# Altium schematic sheet relayNetwork.SchDoc: DE:TMP:11:UC:EXPANDIDO
size 172 x 132 mm; Date: 21-07-2022; SheetNumber: 1; SheetTotal: 1; WebFGR: www.abebashop.com; VersionFGR: 20220721; PageSetup: Record=PageOptions|CenterHorizontal=True|CenterVertical=True|PrintScale=0.94|XCorrection=1.00|YCorrection=1.00|PrintKind=0|BorderSize=5000000|LeftOffset=0|BottomOffset=0|Orientation=2|PaperLength=1000|PaperWidth=1000|Scale=100|PaperSource=7|PrintQuality=-4|MediaType=1|DitherType=10|PaperKind=Letter|PrintScaleMode=1
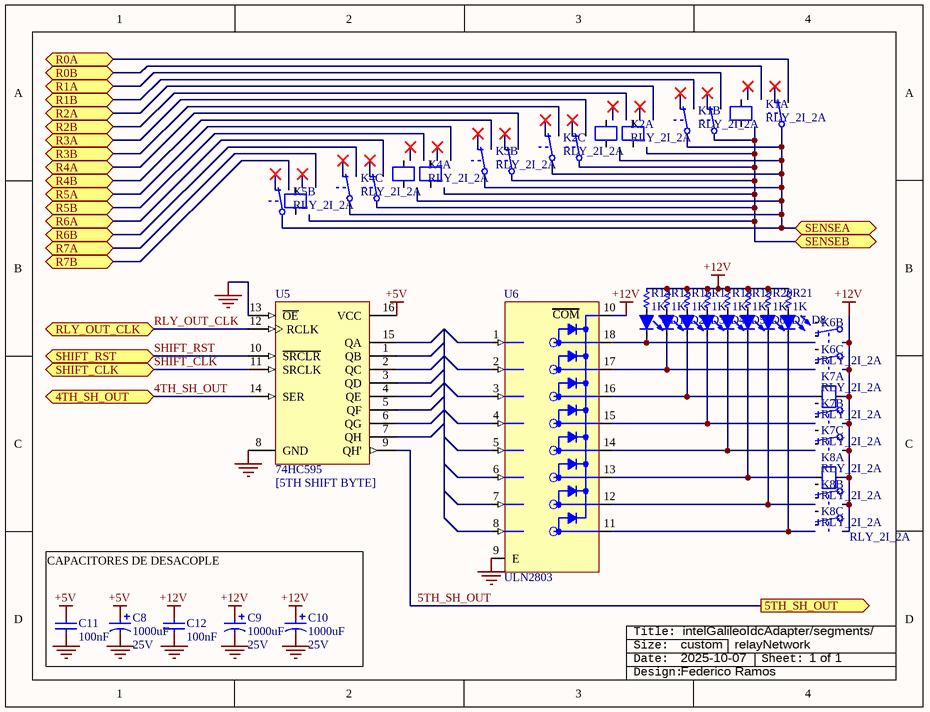
[diagram p0: relayNetwork.SchDoc]

## Parts
C8  value 1000uF  Voltaje: 25V  [C_EL_6-3X11]  (hidden comment: Cap Pol)
C9  value 1000uF  Voltaje: 25V  [C_EL_6-3X11]  (hidden comment: Cap Pol)
C10  value 1000uF  Voltaje: 25V  [C_EL_6-3X11]  (hidden comment: Cap Pol)
C11  value 100nF  [c1206]  (hidden comment: Cap)
C12  value 100nF  [c1206]  (hidden comment: Cap)
D1  Led 5mm Rojo Difuso  [LED5mm ROJO]  (value not drawn)
D2  Led 5mm Rojo Difuso  [LED5mm ROJO]  (value not drawn)
D3  Led 5mm Rojo Difuso  [LED5mm ROJO]  (value not drawn)
D4  Led 5mm Rojo Difuso  [LED5mm ROJO]  (value not drawn)
D5  Led 5mm Rojo Difuso  [LED5mm ROJO]  (value not drawn)
D6  Led 5mm Rojo Difuso  [LED5mm ROJO]  (value not drawn)
D7  Led 5mm Rojo Difuso  [LED5mm ROJO]  (value not drawn)
D8  Led 5mm Rojo Difuso  [LED5mm ROJO]  (value not drawn)
K1  RLY_2I_2A  [relay4]  (parts A,B,C of 3)
K2  RLY_2I_2A  [relay4]  (parts A,B,C of 3)
K3  RLY_2I_2A  [relay4]  (value not drawn)  (parts A,B,C of 3)
K4  RLY_2I_2A  [relay4]  (parts A,B,C of 3)
K5  RLY_2I_2A  [relay4]  (value not drawn)  (parts A,B,C of 3)
K6  RLY_2I_2A  [relay4]  (value not drawn)  (parts A,B,C of 3)
K7  RLY_2I_2A  [relay4]  (parts A,B,C of 3)
K8  RLY_2I_2A  [relay4]  (parts A,B,C of 3)
R14  value 1K  [R1206]  (hidden comment: Res)
R15  value 1K  [R1206]  (hidden comment: Res)
R16  value 1K  [R1206]  (hidden comment: Res)
R17  value 1K  [R1206]  (hidden comment: Res)
R18  value 1K  [R1206]  (hidden comment: Res)
R19  value 1K  [R1206]  (hidden comment: Res)
R20  value 1K  [R1206]  (hidden comment: Res)
R21  value 1K  [R1206]  (hidden comment: Res)
ROT?  Rotulo_empty_longTitle  (value not drawn)  (graphical)
U5  74HC595  [DIP16]
U6  ULN2803  [DIP18Z]

## Ports
4TH_SH_OUT, 5TH_SH_OUT (out), R0A, R0B, R1A, R1B, R2A, R2B, R3A, R3B, R4A, R4B, R5A, R5B, R6A, R6B, R7A, R7B, RLY_OUT_CLK, SENSEA, SENSEB, SHIFT_CLK, SHIFT_RST

## Nets
+5V: C8.1 C11.2 U5.16(VCC)
+12V: C9.1 C10.1 C12.2 K7.5 K8.5 R14.2 R15.2 R16.2 R17.2 R18.2 R19.2 R20.2 R21.2 U6.10(~{COM})
GND: C8.2 C9.2 C10.2 C11.1 C12.1 U5.8(GND) U5.13(~{OE}) U6.9(E)
4TH_SH_OUT: U5.14(SER) ; port 4TH_SH_OUT
5TH_SH_OUT: U5.9(QH') ; port 5TH_SH_OUT
R0A: K1.8 ; port R0A
R1A: K2.3 ; port R1A
R1B: K1.3 ; port R1B
R3A: K3.8 ; port R3A
R3B: K2.8 ; port R3B
R4A: K4.3 ; port R4A
R4B: K3.3 ; port R4B
R6A: K5.8 ; port R6A
R6B: K4.8 ; port R6B
R7B: K5.3 ; port R7B
RLY_OUT_CLK: U5.12(RCLK) ; port RLY_OUT_CLK
SENSEA: K1.1 K1.6 K2.6 K3.1 K4.6 K5.1 ; port SENSEA
SENSEB: K2.1 K3.6 K4.1 K5.6 ; port SENSEB
SHIFT_CLK: U5.11(SRCLK) ; port SHIFT_CLK
SHIFT_RST: U5.10(~{SRCLR}) ; port SHIFT_RST
NetD1_1: D1.1(A) R14.1
NetD1_2: D1.2(K) U6.18(~{C}1)
NetD2_1: D2.1(A) R15.1
NetD2_2: D2.2(K) U6.17(~{C}2)
NetD3_1: D3.1(A) R16.1
NetD3_2: D3.2(K) K7.4 U6.16(~{C}3)
NetD4_1: D4.1(A) R17.1
NetD4_2: D4.2(K) U6.15(~{C}4)
NetD5_1: D5.1(A) R18.1
NetD5_2: D5.2(K) U6.14(~{C}5)
NetD6_1: D6.1(A) R19.1
NetD6_2: D6.2(K) K8.4 U6.13(~{C}6)
NetD7_1: D7.1(A) R20.1
NetD7_2: D7.2(K) U6.12(~{C}7)
NetD8_1: D8.1(A) R21.1
NetD8_2: D8.2(K) U6.11(~{C}8)

Not connected (* = marked no-connect by the designer): K1 2* 4 5 7*; K2 2* 4 5 7*; K3 2* 4 5 7*; K4 2* 4 5 7*; K5 2* 4 5 7*; K6 1 2 3 4 5 6 7 8; K7 1 2 3 6 7 8; K8 1 2 3 6 7 8; U5 1(QB) 2(QC) 3(QD) 4(QE) 5(QF) 6(QG) 7(QH) 15(QA); U6 1(B1) 2(B2) 3(B3) 4(B4) 5(B5) 6(B6) 7(B7) 8(B8)

## Notes on the sheet
- CAPACITORES DE DESACOPLE
- custom
- 2025-10-07
- (near ROT?) intelGalileoIdcAdapter/segments/
- relayNetwork
- (near ROT?) 1 of 1
- Federico Ramos
- (in symbol 74HC595) [5TH SHIFT BYTE]
- (in symbol Rotulo_empty_longTitle) Title:; Size:; Date:; Sheet:; Design:
- (in symbol ULN2803) COM

## Library data of the parts
C8-C10 = Cap Pol: Capacitor Electrolítico; Price: ?
C11 C12 = Cap: Capacitor; Voltage: 50V; Price: 0.25; Technology: Ceramic
D1-D8 = Led 5mm Rojo Difuso: Codigo Ebay: NA; Dolares Ebay: 0.06
R14-R21 = Res: Resistencia; Power: 0.25W; Price: 0.036
ROT? = Rotulo_empty_longTitle: Rotulo [consolas]
U5 = 74HC595: 8-Bit Shift Register with 3-State Output Registers
U6 = ULN2803: Darlington Transistor Array; Price: 1.40